# EasyEDA schematic SCH_MAN4HEALTH_2023-02-25.json
TITLE: Sheet_1; REV: 1.0; Date: 2022-07-11; Sheet: 1/1; Drawn By: João Paulo Coelho; Company: Your Company
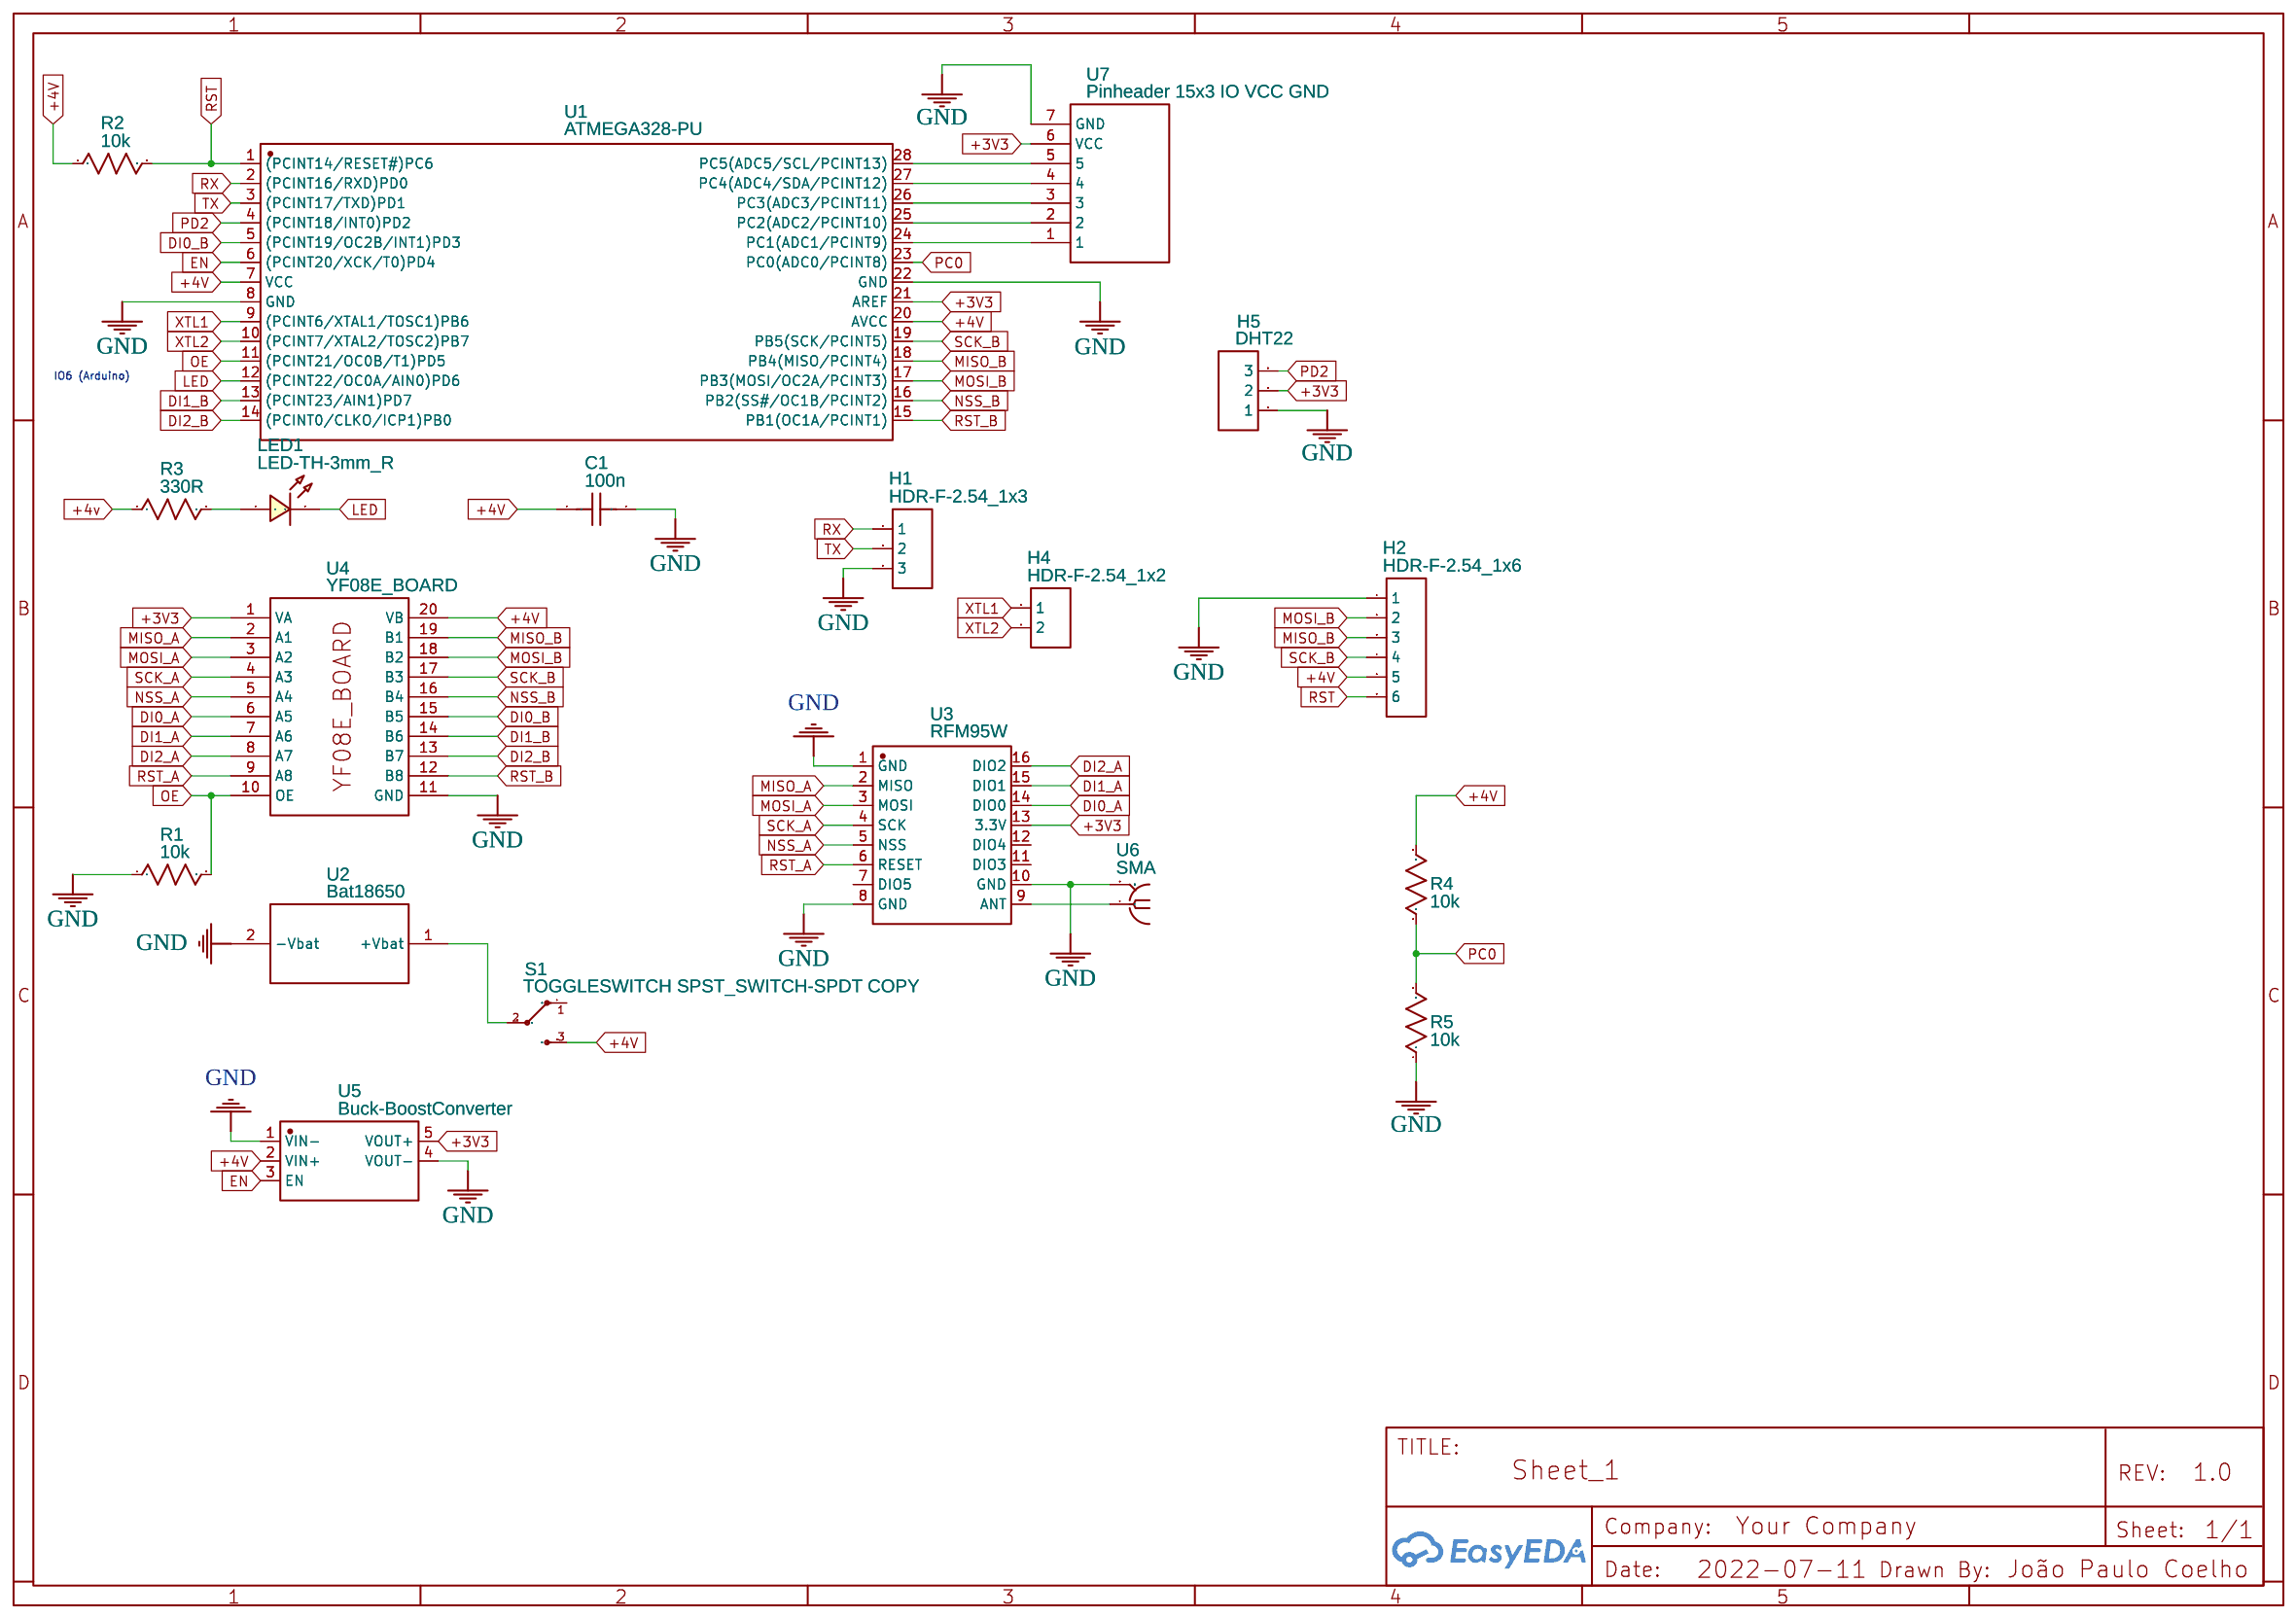
[diagram p0: schematic sheet]

## Parts
C1  100n  [RAD-0.1]
H1  HDR-F-2.54_1x3  [HDR-F-2.54_1X3]
H2  HDR-F-2.54_1x6  [HDR-F-2.54_1X6]
H4  HDR-F-2.54_1x2  [HDR-F-2.54_1X2]
H5  DHT22  [HDR-F-2.54_1X3]
LED1  LED-TH-3mm_R  [LED-TH_BD3.0_RED]
R1  10k  [R_AXIAL-0.3]
R2  10k  [R_AXIAL-0.3]
R3  330R  [R_AXIAL-0.3]
R4  10k  [R_AXIAL-0.3]
R5  10k  [R_AXIAL-0.3]
S1  TOGGLESWITCH SPST_SWITCH-SPDT COPY  [3-PIN SPDT SLIDE SWITCH]
U1  ATMEGA328-PU  [DIP-28_L35.0-W6.5-P2.54-LS7.6-BL]
U2  Bat18650  [BAT18650]
U3  RFM95W  [COMM-SMD_RFM95W]
U4  YF08E_BOARD  [YF08E_BOARD]
U5  Buck-BoostConverter  [BUCK-BOOSTCONVERTER]
U6  SMA  [SMA-2]
U7  Pinheader 15x3 IO VCC GND  [PINHEADER 5X3 IO VCC GND]

## Library data of the parts
C1 = C_RAD-0.1_US: Contributor: LCEDA_Lib
H1 H5 = HDR-F-2.54_1x3: Supplier Part: C146690; Supplier: LCSC; Contributor: LCEDA_Lib
H2 = HDR-F-2.54_1x6: Supplier Part: C40877; Supplier: LCSC; Contributor: LCEDA_Lib
H4 = HDR-F-2.54_1x2: Supplier Part: C49661; Supplier: LCSC; Contributor: LCEDA_Lib
LED1 = LED-TH-3mm_R: Manufacturer: EVERLIGHT(台湾亿光); Manufacturer Part: 204-10SDRD/S530-A3-L; Supplier Part: C84774; Supplier: LCSC; Contributor: LCEDA_Lib
R1-R3 = R_AXIAL-0.3_US: Contributor: LCEDA_Lib
R4 R5 = R_0603_US: Contributor: LCEDA_Lib
S1 = TOGGLESWITCH SPST_SWITCH-SPDT COPY: sourceId: ceKgMGAuL; Contributor: matmatis
U1 = ATMEGA328-PU: Supplier: LCSC; Supplier Part: C613508; Manufacturer: MICROCHIP(美国微芯); Contributor: LCSC; JLCPCB Part Class: Extended Part
U2 = Bat18650: Contributor: jpcoelho1974
U3 = RFM95W: Supplier: LCSC; Supplier Part: C9900000484; JLCPCB Part Class: Extended Part; link: https://www.hoperf.com/modules/lora/RFM95.html; Contributor: LCSC
U4 = YF08E_BOARD: Supplier: ALI; Contributor: hmelik
U5 = Buck-BoostConverter: Manufacturer Part: ME; Contributor: Natsuki-chan
U6 = SMA: sourceId: yjhN5dICw
U7 = Pinheader 15x3 IO VCC GND: Contributor: Romina Giugge

## Nets
+3V3: H5.2 U1.21(AREF) U3.13(3.3V) U4.1(VA) U5.5(VOUT+) U7.6(VCC)
+4V: C1.1 H2.5 R2.1 R4.2 S1.3(S) U1.7(VCC) U1.20(AVCC) U4.20(VB) U5.2(VIN+)
+4v: R3.1
GND: C1.2 H1.3 H2.1 H5.1 R1.1 R5.1 U1.8(GND) U1.22(GND) U2.2(-Vbat) U3.1(GND) U3.8(GND) U3.10(GND) U4.11(GND) U5.1(VIN-) U5.4(VOUT-) U6.2(GND) U7.7(GND)
DI0_A: U3.14(DIO0) U4.6(A5)
DI0_B: U1.5((PCINT19/OC2B/INT1)PD3) U4.15(B5)
DI1_A: U3.15(DIO1) U4.7(A6)
DI1_B: U1.13((PCINT23/AIN1)PD7) U4.14(B6)
DI2_A: U3.16(DIO2) U4.8(A7)
DI2_B: U1.14((PCINT0/CLKO/ICP1)PB0) U4.13(B7)
EN: U1.6((PCINT20/XCK/T0)PD4) U5.3(EN)
LED: LED1.2 U1.12((PCINT22/OC0A/AIN0)PD6)
MISO_A: U3.2(MISO) U4.2(A1)
MISO_B: H2.3 U1.18(PB4(MISO/PCINT4)) U4.19(B1)
MOSI_A: U3.3(MOSI) U4.3(A2)
MOSI_B: H2.2 U1.17(PB3(MOSI/OC2A/PCINT3)) U4.18(B2)
NSS_A: U3.5(NSS) U4.5(A4)
NSS_B: U1.16(PB2(SS#/OC1B/PCINT2)) U4.16(B4)
OE: R1.2 U1.11((PCINT21/OC0B/T1)PD5) U4.10(OE)
PC0: R4.1 R5.2 U1.23(PC0(ADC0/PCINT8))
PD2: H5.3 U1.4((PCINT18/INT0)PD2)
RST: H2.6 R2.2 U1.1((PCINT14/RESET#)PC6)
RST_A: U3.6(RESET) U4.9(A8)
RST_B: U1.15(PB1(OC1A/PCINT1)) U4.12(B8)
RX: H1.1 U1.2((PCINT16/RXD)PD0)
SCK_A: U3.4(SCK) U4.4(A3)
SCK_B: H2.4 U1.19(PB5(SCK/PCINT5)) U4.17(B3)
TX: H1.2 U1.3((PCINT17/TXD)PD1)
XTL1: H4.1 U1.9((PCINT6/XTAL1/TOSC1)PB6)
XTL2: H4.2 U1.10((PCINT7/XTAL2/TOSC2)PB7)
Net-(LED1-1): LED1.1 R3.2
Net-(S1-2): S1.2(P) U2.1(+Vbat)
Net-(U1-24): U1.24(PC1(ADC1/PCINT9)) U7.1
Net-(U1-25): U1.25(PC2(ADC2/PCINT10)) U7.2
Net-(U1-26): U1.26(PC3(ADC3/PCINT11)) U7.3
Net-(U1-27): U1.27(PC4(ADC4/SDA/PCINT12)) U7.4
Net-(U1-28): U1.28(PC5(ADC5/SCL/PCINT13)) U7.5
Net-(U3-9): U3.9(ANT) U6.1

Not connected (* = marked no-connect by the designer): S1 1(O); U3 7(DIO5) 11(DIO3) 12(DIO4)

## Notes on the sheet
- IO6 (Arduino)
